# EAGLE design simple-loop1 (EAGLE 6.6.0)
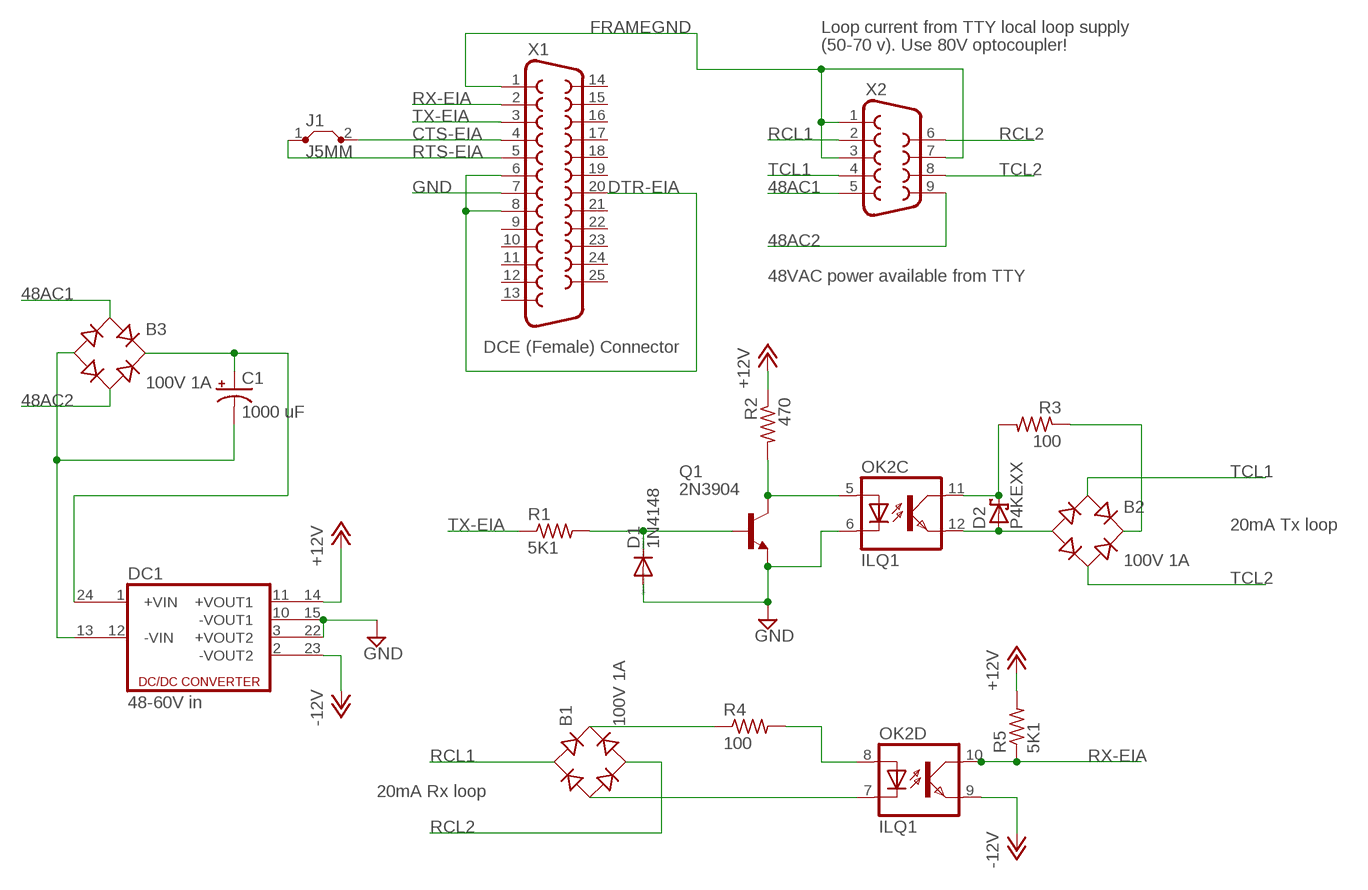
[diagram p0: schematic, sheet 1]

## Parts
B1  100V 1A  RB1A  [RB1A]
B2  100V 1A  RB1A  [RB1A]
B3  100V 1A  RB1A  [RB1A]
C1  1000 uF  CPOL-USE7.5-18  [E7,5-18]
D1  1N4148  1N4148DO35-10  [DO35-10]
D2  P4KEXX  [DO41-10]
DC1  48-60V in  DCW2U  [DCW]
J1  J5MM  [05]
OK2  ILQ1  [DIL16]
Q1  2N3904  [TO92]
R1  5K1  R-US_0207/10  [0207/10]
R2  470  R-US_0207/10  [0207/10]
R3  100  R-US_0207/10  [0207/10]
R4  100  R-US_0207/10  [0207/10]
R5  5K1  R-US_0207/10  [0207/10]
X1  F25H  [F25H]
X2  F09H  [F09H]

## Nets
48AC1: B3.AC1 X2.5
48AC2: B3.AC2 X2.9
+12V: DC1.14(+VOUT) R2.1 R5.2
-12V: DC1.23(-VOUT) OK2.9(D:EMIT)
CTS-EIA: J1.2 X1.4
DTR-EIA: X1.6 X1.8 X1.20
FRAMEGND: X1.1 X2.1 X2.3 X2.7
GND: D1.A DC1.15(-VOUT) DC1.22(+VOUT) OK2.6(C:C) Q1.3(E) X1.7
N$1: OK2.8(D:A) R4.2
N$2: B1.+ R4.1
N$3: B1.- OK2.7(D:C)
N$4: B2.- D2.A OK2.12(C:EMIT)
N$5: B2.+ R3.1
N$6: D2.C OK2.11(C:COL) R3.2
N$7: D1.C Q1.2(B) R1.2
N$8: B3.+ C1.+ DC1.24(+VIN1)
N$9: OK2.5(C:A) Q1.1(C) R2.2
N$10: B3.- C1.- DC1.13(-VIN1)
RCL1: B1.AC1 X2.2
RCL2: B1.AC2 X2.6
RTS-EIA: J1.1 X1.5
RX-EIA: OK2.10(D:COL) R5.1 X1.2
TCL1: B2.AC1 X2.4
TCL2: B2.AC2 X2.8
TX-EIA: R1.1 X1.3
Unconnected: DC1.1(+VIN) DC1.2(-VOUT2) DC1.3(+VOUT2) DC1.10(-VOUT1) DC1.11(+VOUT1) DC1.12(-VIN) OK2.1(A:A) OK2.2(A:C) OK2.3(B:C) OK2.4(B:A) OK2.13(B:EMIT) OK2.14(B:COL) OK2.15(A:COL) OK2.16(A:EMIT) X1.9 X1.10 X1.11 X1.12 X1.13 X1.14 X1.15 X1.16 X1.17 X1.18 X1.19 X1.21 X1.22 X1.23 X1.24 X1.25

## Notes on the sheet
- Loop current from TTY local loop supply
- (50-70 v). Use 80V optocoupler!
- 48VAC power available from TTY
- DCE (Female) Connector
- 20mA Tx loop
- 20mA Rx loop

## Library data of the parts
B1-B3 = rectifier:RB1A: RECTIFIER 1 A
C1 = rcl:CPOL-US: POLARIZED CAPACITOR, American symbol
D1 = diode:1N4148: DIODE high speed (Philips)
D2 = diode:P4KEXX: DIODE transient-voltage suppressor
DC1 = dc-dc-converter:DCW2U: DC-DC CONVERTER; OC_FARNELL: unknown; OC_NEWARK: unknown
J1 = jumper:J: Bridge
OK2 = optocoupler:ILQ1: SIEMENS OPTO COUPLER; MF: VISHAY/TELEFUNKEN; MPN: ILQ1; OC_FARNELL: 1469501; OC_NEWARK: 88K1954
Q1 = transistor-npn:2N3904: NPN Transistor
R1-R5 = rcl:R-US_: RESISTOR, American symbol
X1 = con-subd:F25: SUB-D; OC_FARNELL: unknown; OC_NEWARK: unknown
X2 = con-subd:F09: SUB-D; OC_FARNELL: unknown; OC_NEWARK: unknown

## Board
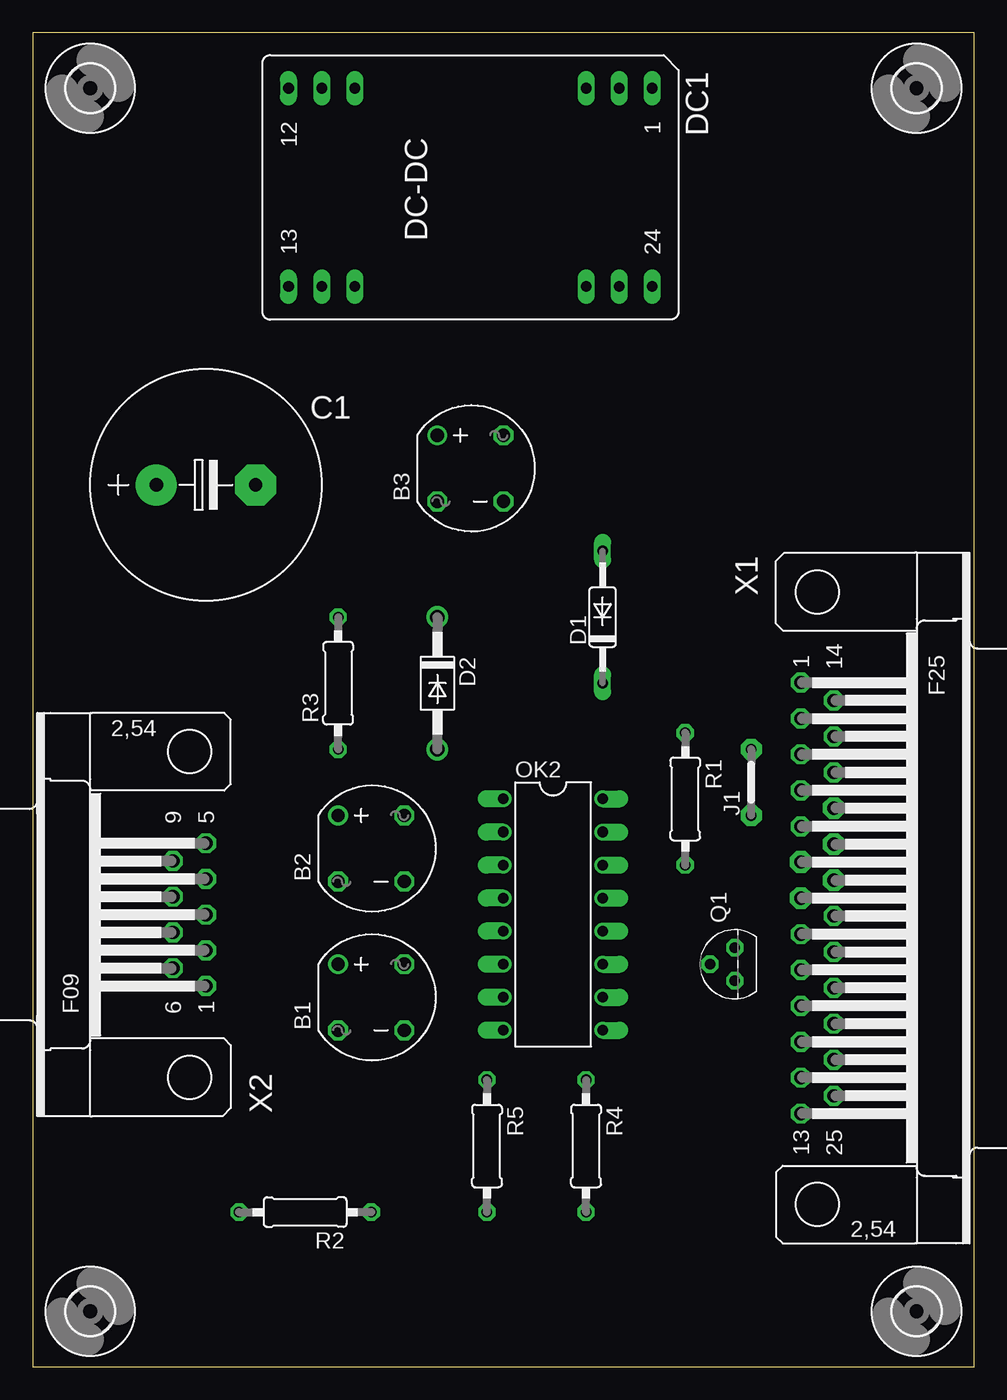
[diagram p1: board, top side]
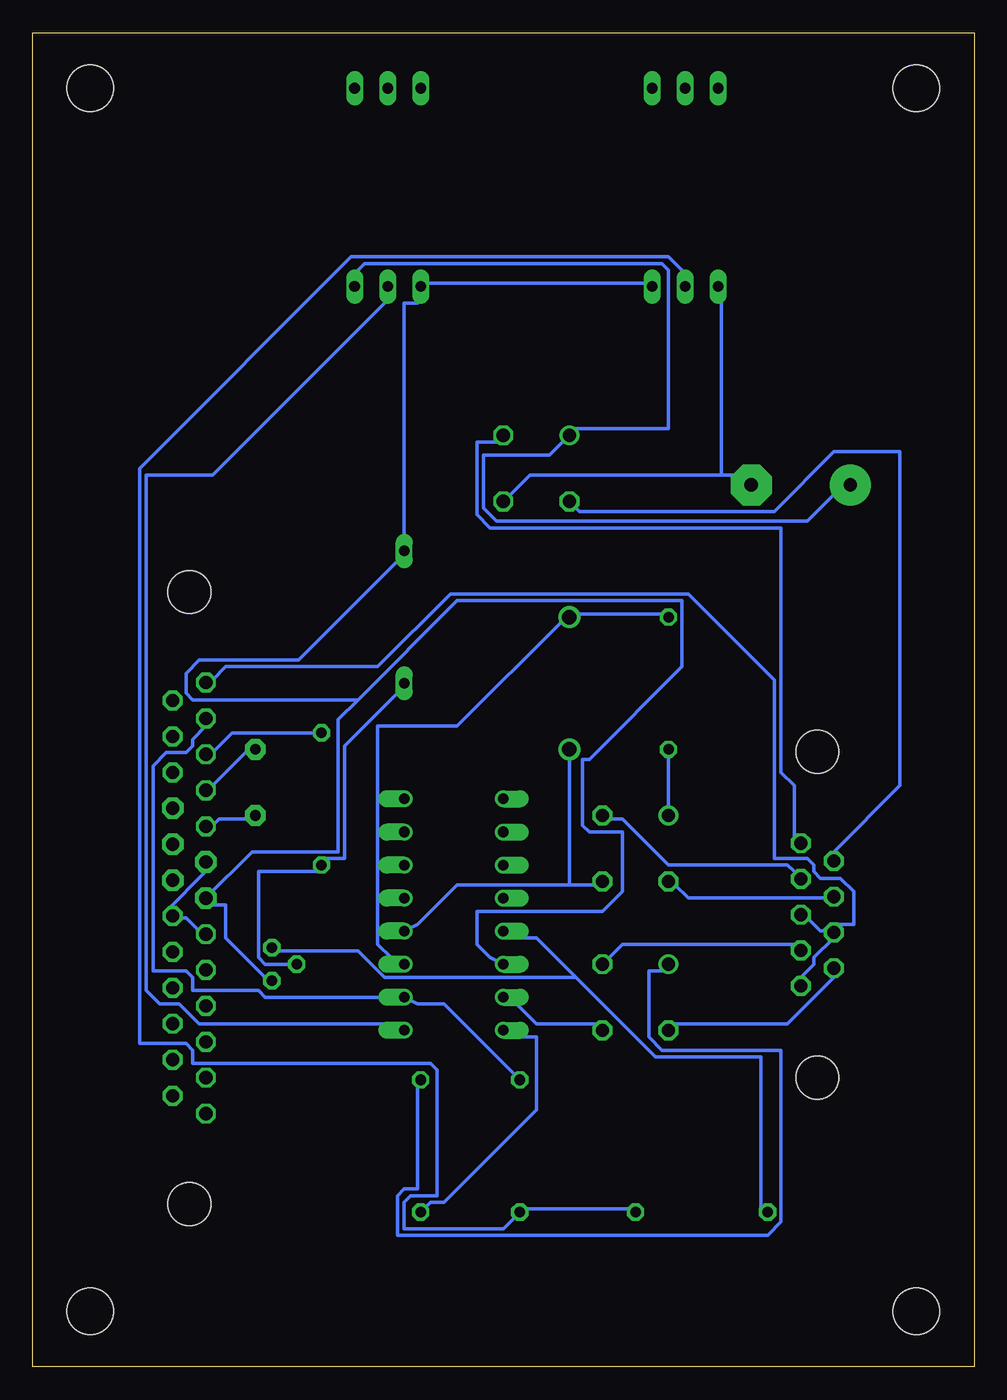
[diagram p2: board, bottom side, seen from below]

Size 72.37 x 102.54 mm. Coordinates in mm from the lower left corner, seen from the top.
Outline: 0,0 72.37,0 72.37,102.54 0,102.54 0,0
Copper layers (1*16): Top 0.035mm / dielectric 1.5mm / Bottom 0.035mm
Design rules "default *": minimum track width 10mil, minimum drill 24mil, track to track 8mil, track to pad 8mil, pad to pad 8mil, via to via 8mil, smd to smd 8mil, copper to edge 40mil, drill to drill 8mil, minimum pad ring 10mil, minimum via ring 8mil, stop-mask expansion 4mil, vias tented up to drill 0mil, thermal gap 10mil

### Footprints (pad centres in the part's own frame; a part is rotated, then mirrored left to right if it is on the bottom)
RB1A = drill 1.016: + -2.54,2.54 | drill 1.016 octagon: - 2.54,-2.54; AC1 2.54,2.54; AC2 -2.54,-2.54
E7,5-18 = drill 1.016 pad 3.15: + -3.81,0 | drill 1.016 pad 3.15 octagon: - 3.81,0
DO35-10 = drill 0.813 long: A 5.08,0; C -5.08,0
DO41-10 = drill 1.118: A 5.08,0; C -5.08,0
DCW = drill 0.813 long: 1 -7.62,13.97; 2 -7.62,11.43; 3 -7.62,8.89; 10 -7.62,-8.89; 11 -7.62,-11.43; 12 -7.62,-13.97; 13 7.62,-13.97; 14 7.62,-11.43; 15 7.62,-8.89; 22 7.62,8.89; 23 7.62,11.43; 24 7.62,13.97
05 = drill 0.813 pad 1.6 octagon: 1 -2.54,0; 2 2.54,0
DIL16 = drill 0.813 offset: 1 -8.89,-3.81; 2 -6.35,-3.81; 3 -3.81,-3.81; 4 -1.27,-3.81; 5 1.27,-3.81; 6 3.81,-3.81; 7 6.35,-3.81; 8 8.89,-3.81; 9 8.89,3.81; 10 6.35,3.81; 11 3.81,3.81; 12 1.27,3.81; 13 -1.27,3.81; 14 -3.81,3.81; 15 -6.35,3.81; 16 -8.89,3.81
TO92 = drill 0.813 octagon: 1 1.27,0; 2 0,1.905; 3 -1.27,0
0207/10 = drill 0.813 octagon: 1 -5.08,0; 2 5.08,0
3,6 = hole 3.6: 0,0
F25H = drill 1.016 octagon: 1 -16.561,-1.27; 2 -13.792,-1.27; 3 -11.049,-1.27; 4 -8.28,-1.27; 5 -5.512,-1.27; 8 2.769,-1.27; 9 5.512,-1.27; 10 8.28,-1.27; 11 11.049,-1.27; 12 13.792,-1.27; 13 16.561,-1.27; 14 -15.189,1.27; 15 -12.421,1.27; 16 -9.652,1.27; 20 1.372,1.27; 21 4.14,1.27; 22 6.909,1.27; 23 9.652,1.27; 24 12.421,1.27; 25 15.189,1.27 | drill 1.016 pad 1.67 octagon: 6 -2.769,-1.27; 7 0,-1.27; 17 -6.909,1.27; 18 -4.14,1.27; 19 -1.372,1.27 | hole 3.302: -23.52,0; 23.52,0
F09H = drill 1.016 octagon: 1 -5.486,-1.27; 2 -2.743,-1.27; 3 0,-1.27; 4 2.743,-1.27; 5 5.486,-1.27; 6 -4.115,1.27; 7 -1.372,1.27; 8 1.372,1.27; 9 4.115,1.27 | hole 3.302: -12.522,0; 12.522,0

### Placement (x,y rotation side)
B1  26.03,28.41 0 top
B2  26.03,39.84 0 top
B3  33.65,69.05 0 top
C1  13.33,67.78 0 top
D1  43.81,57.62 90 top
D2  31.11,52.54 270 top
DC1  33.65,90.64 270 top
J1  55.24,44.92 90 top
OK2  40,34.76 270 top
Q1  53.97,30.95 90 top
R1  50.16,43.65 270 top
R2  20.95,11.9 180 top
R3  23.49,52.54 90 top
R4  42.54,16.98 270 top
R5  34.92,16.98 270 top
U$1  [3,6]  67.94,98.26 0 top
U$2  [3,6]  4.44,98.26 0 top
U$3  [3,6]  4.44,4.28 0 top
U$4  [3,6]  67.94,4.28 0 top
X1  60.32,36.03 270 top
X2  12.06,34.76 90 top

### Tracks (layer width: path | path; a pad name or v marks a point on that pad's centre or on a via)
48AC1
  Bottom 0.254: X2.5 13.84,40.6 13.84,44.67 14.85,45.68 14.85,64.48 37.21,64.48 38.22,65.49 38.22,71.08 36.7,71.08 B3.AC1
48AC2
  Bottom 0.254: X2.9 10.79,39.59 5.71,44.67 5.71,70.32 10.79,70.32 15.36,65.75 30.35,65.75 B3.AC2
+12V
  Bottom 0.254: R2.1 26.54,12.15 34.67,12.15 R5.2 36.19,10.63 43.81,10.63 43.81,12.66 43.3,13.17 41.27,13.17 41.27,22.82 41.78,23.33 60.07,23.33 60.07,24.35 60.57,24.85 64.13,24.85 64.13,69.05 47.87,85.31 23.49,85.31 22.47,84.29 DC1.14
-12V
  Bottom 0.254: OK2.9 44.83,26.38 59.56,26.38 61.08,27.9 62.61,27.9 63.62,28.92 63.62,68.54 58.54,68.54 45.33,81.75 DC1.23
CTS-EIA
  Bottom 0.254: X1.4 58.54,44.67 56,47.21 J1.2
DTR-EIA
  Bottom 0.254: X1.8 59.56,33.49 60.57,34.51 61.08,34.51 X1.20 62.1,35.01 59.05,38.06 X1.6
FRAMEGND
  Bottom 0.254: X2.1 13.33,29.93 12.31,30.95 12.31,31.46 10.79,32.98 X2.7 | X2.3 12.82,34.51 11.81,33.49 11.3,33.49 X2.7 | X1.1 58.54,52.79 57.53,53.81 45.84,53.81 40.25,59.4 21.97,59.4 15.36,52.79 15.36,39.08 12.82,39.08 12.31,38.57 12.31,38.06 11.81,37.55 10.28,37.55 9.27,36.54 9.27,34 10.79,34 X2.7
GND
  Bottom 0.254: DC1.15 25.01,83.27 42.29,83.27 DC1.22 42.79,81.75 43.81,81.75 D1.A 44.32,61.94 51.94,54.32 59.56,54.32 60.57,53.3 60.57,51.78 60.07,51.27 47.37,51.27 | 47.37,51.27 48.89,49.75 48.89,39.59 55.49,39.59 X1.7 58.54,35.52 57.53,35.52 57.53,32.98 54.48,29.93 Q1.3 | 47.37,51.27 39.75,58.89 22.47,58.89 22.47,53.81 29.59,46.7 30.09,46.7 30.09,41.62 29.59,41.11 27.05,41.11 27.05,36.54 28.57,35.01 38.22,35.01 38.22,32.47 37.21,31.46 OK2.6
N$1
  Bottom 0.254: R4.2 41.78,12.66 40.76,12.66 33.65,19.77 33.65,25.36 35.17,25.36 OK2.8
N$2
  Bottom 0.254: R4.1 42.79,21.81 42.79,13.68 43.81,13.68 44.32,13.17 44.32,10.12 15.87,10.12 14.85,11.14 14.85,24.35 24,24.35 25.01,25.36 25.01,30.44 24,30.44 B1.+
N$3
  Bottom 0.254: OK2.7 35.17,27.9 33.65,26.38 29.08,26.38 B1.-
N$4
  Bottom 0.254: 31.11,37.05 29.08,37.05 B2.- | 31.11,37.05 39.75,37.05 42.79,34 OK2.12 | 31.11,37.05 D2.A
N$5
  Bottom 0.254: B2.+ R3.1
N$6
  Bottom 0.254: OK2.11 44.83,31.46 45.84,32.47 45.84,49.24 39.75,49.24 31.62,57.37 D2.C 30.6,57.87 24,57.87 R3.2
N$7
  Bottom 0.254: D1.C 44.32,51.78 48.38,47.71 48.38,39.08 49.91,39.08 R1.2 50.41,38.06 54.99,38.06 54.99,31.46 54.48,30.95 Q1.2
N$8
  Bottom 0.254: DC1.24 47.37,84.29 46.86,84.8 24,84.8 23.49,84.29 23.49,72.1 30.6,72.1 B3.+ 32.63,70.07 37.71,70.07 37.71,66 36.7,64.99 12.82,64.99 10.28,67.53 C1.+
N$9
  Bottom 0.254: 30.6,29.93 33.65,32.98 35.17,32.98 OK2.5 | 30.6,29.93 24.51,23.84 16.38,23.84 16.38,12.15 R2.2 | 30.6,29.93 45.33,29.93 47.37,31.97 53.46,31.97 Q1.1
N$10
  Bottom 0.254: 19.43,68.54 19.43,81.75 DC1.13 | 19.43,68.54 17.39,68.54 C1.- | 19.43,68.54 34.16,68.54 B3.-
RCL1
  Bottom 0.254: X2.2 13.84,32.47 27.05,32.47 B1.AC1
RCL2
  Bottom 0.254: X2.6 10.79,29.93 14.35,26.38 22.98,26.38 B1.AC2
RTS-EIA
  Bottom 0.254: X1.5 58.54,41.62 58.03,42.13 56,42.13 J1.1
RX-EIA
  Bottom 0.254: R5.1 40.76,27.9 42.79,27.9 OK2.10 54.48,28.41 54.99,28.92 60.07,28.92 60.07,29.93 60.57,30.44 63.11,30.44 63.11,46.19 62.1,47.21 60.57,47.21 60.07,47.71 60.07,48.22 59.05,49.24 X1.2
TCL1
  Bottom 0.254: X2.4 13.84,38.06 14.35,38.57 23.49,38.57 27.05,42.13 28.06,42.13 B2.AC1
TCL2
  Bottom 0.254: X2.8 11.3,36.03 21.97,36.03 22.98,37.05 B2.AC2
TX-EIA
  Bottom 0.254: R1.1 57.02,48.73 58.54,47.21 X1.3